# Altium schematic sheet Sheet-PT-100.SchDoc
size A4; SheetNumber: 1; SheetTotal: 1
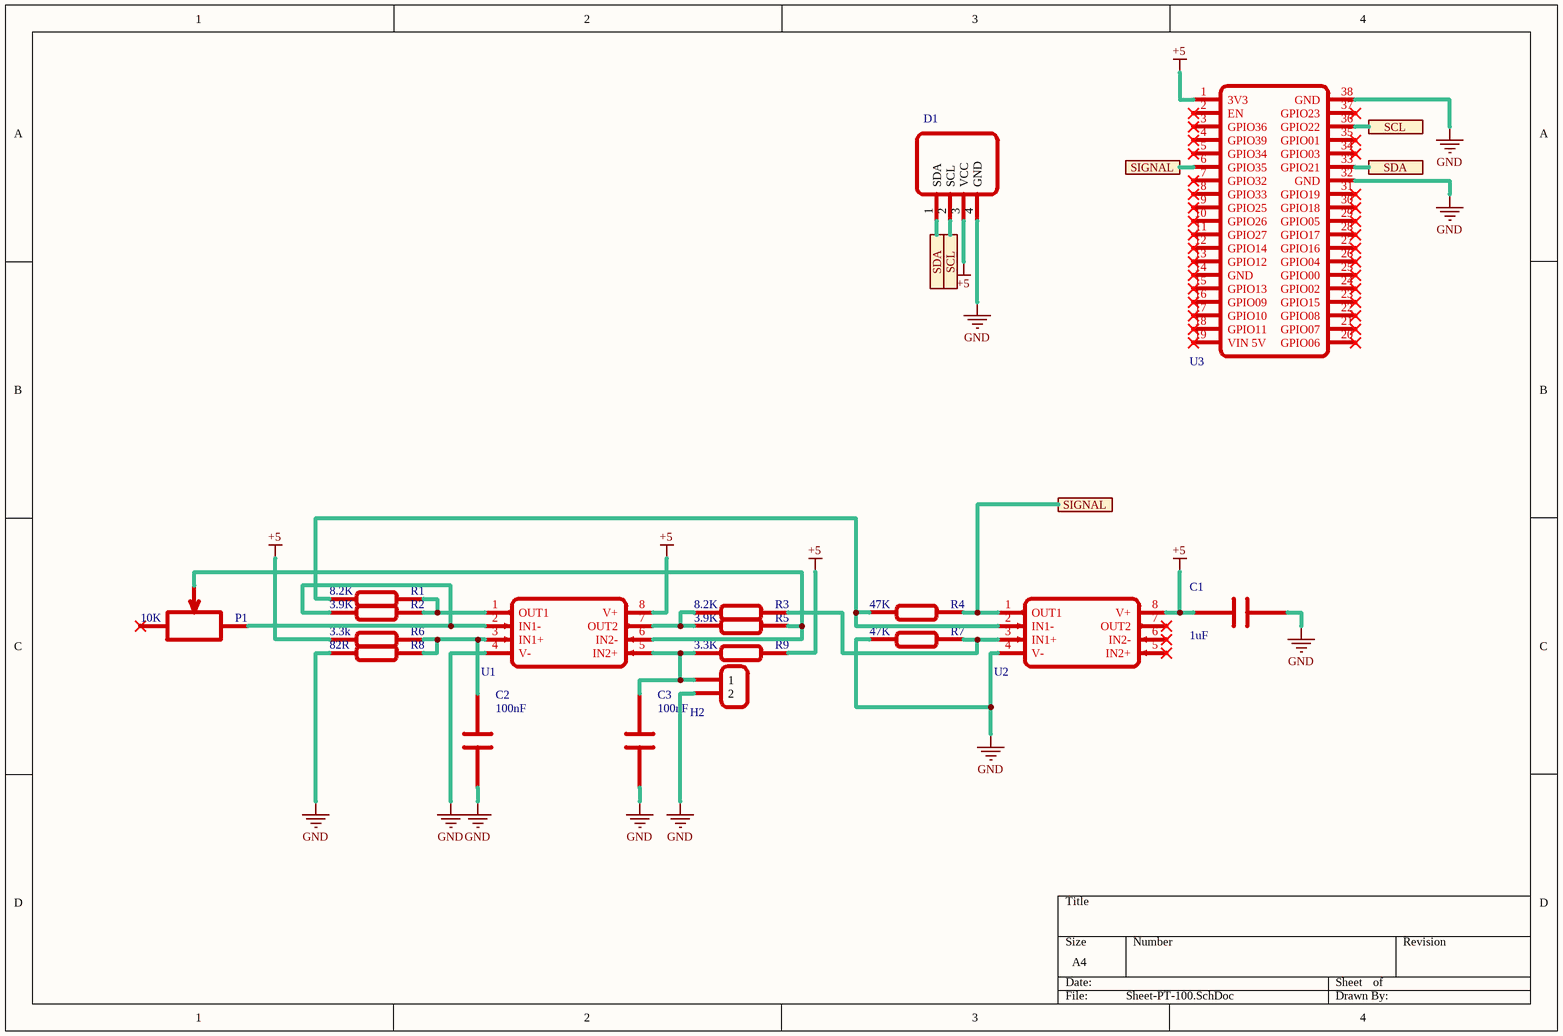
[diagram p0: Sheet-PT-100.SchDoc]

## Parts
C1  1uF  [Cap-Rad-Cer-D3.5-L1.5-P2.5]
C2  100nF  [Cap-Rad-Cer-D3.5-L1.5-P2.5]
C3  100nF  [Cap-Rad-Cer-D3.5-L1.5-P2.5]
D1  SSD1306-0.96-128X32-I2C  [SSD1306-0.96-12832-I2C]  (value not drawn)
H2  CONN-2P  [HDR-M-2.54-2P]  (value not drawn)
P1  10K  [3296X]
R1  8.2K  [Res Axial 0.3]
R2  3.9K  [Res Axial 0.3 Vertical]
R3  8.2K  [Res Axial 0.3]
R4  47K  [Res Axial 0.3 Vertical]
R5  3.9K  [Res Axial 0.3 Vertical]
R6  3.3k  [Res Axial 0.3]
R7  47K  [Res Axial 0.3 Vertical]
R8  82R  [Res Axial 0.3]
R9  3.3K  [Res Axial 0.3]
U1  LM358  [DIP8]  (value not drawn)
U2  LM358  [DIP8]  (value not drawn)
U3  ESP32-DEV-KIT  [ESP32-WROOM-32-38PIN]  (value not drawn)

## Ports
SCL, SDA, SIGNAL

## Nets
+5: C1.1 D1.3(VCC) R6.1 R9.2 U1.8(V+) U2.8(V+) U3.1(3V3)
GND: C1.2 C2.1 C3.1 D1.4(GND) H2.2 R7.2 R8.1 U1.4(V-) U2.4(V-) U3.32(GND) U3.38(GND)
SCL: D1.2(SCL) U3.36(GPIO22) ; port SCL
SDA: D1.1(SDA) U3.33(GPIO21) ; port SDA
SIGNAL: R4.1 U2.1(OUT1) U3.6(GPIO35) ; port SIGNAL
NetC2_2: C2.2 R6.2 R8.2 U1.3(IN1+)
NetC3_2: C3.2 H2.1 R9.1 U1.5(IN2+)
NetP1_2: P1.2 R5.1 U1.6(IN2-)
NetP1_3: P1.3 R2.1 U1.2(IN1-)
NetR1_1: R1.1 R4.2 U2.2(IN1-)
NetR1_2: R1.2 R2.2 U1.1(OUT1)
NetR3_1: R3.1 R5.2 U1.7(OUT2)
NetR3_2: R3.2 R7.1 U2.3(IN1+)

Not connected (* = marked no-connect by the designer): P1 1*; U2 5(IN2+)* 6(IN2-)* 7(OUT2)*; U3 2(EN)* 3(GPIO36)* 4(GPIO39)* 5(GPIO34)* 7(GPIO32)* 8(GPIO33)* 9(GPIO25)* 10(GPIO26)* 11(GPIO27)* 12(GPIO14)* 13(GPIO12)* 14(GND)* 15(GPIO13)* 16(GPIO09)* 17(GPIO10)* 18(GPIO11)* 19(VIN_5V)* 20(GPIO06)* 21(GPIO07)* 22(GPIO08)* 23(GPIO15)* 24(GPIO02)* 25(GPIO00)* 26(GPIO04)* 27(GPIO16)* 28(GPIO17)* 29(GPIO05)* 30(GPIO18)* 31(GPIO19)* 34(GPIO03)* 35(GPIO01)* 37(GPIO23)*

## Library data of the parts
C1-C3 = CAP-CER: Ceramic Capacitor
D1 = SSD1306-0.96-128X32-I2C: SSD1306-0.96inch 128X32 I2C 4P; ComponentLink1Description: WEO012832DWPP3N00008; ComponentLink1URL: https://www.winstar.com.tw/d/447/WEO012832DWPP3N00008.pdf
H2 = CONN-2P: Connector 2 Pole
P1 = 3296x: Potentionmeter; ComponentLink1Description: 3296x Potentionmeter Square Trimpot Series; ComponentLink1URL: https://www.bourns.com/docs/product-datasheets/3296.pdf
R1-R9 = Resistor
U1 U2 = LM358: Low-power dual Operational Amplifier; ComponentLink1Description: LM358M Datasheets; ComponentLink1URL: https://www.ti.com/general/docs/suppproductinfo.tsp?distId=10&gotoUrl=https%3A%2F%2Fwww.ti.com%2Flit%2Fgpn%2Flm158-n
U3 = ESP32-DEVKIT: ESP32 Dev Kit module 38 Pin